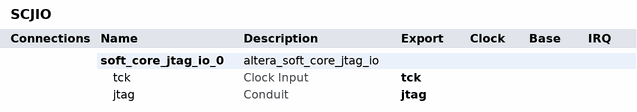
[diagram p0: system contents]
# Platform Designer (Qsys) system SCJIO, Arria 10 10AX115N2F40E2LG
# Parameters at their usual value, and those the tool derives, are not listed.
package require -exact qsys 19.1
create_system SCJIO
set_project_property DEVICE_FAMILY {Arria 10}
set_project_property DEVICE 10AX115N2F40E2LG

add_instance soft_core_jtag_io_0 altera_soft_core_jtag_io 19.1
set_instance_property soft_core_jtag_io_0 AUTO_EXPORT true
set_instance_parameter_value soft_core_jtag_io_0 CONNECTED_TO_JTAG_ATOM false
set_instance_parameter_value soft_core_jtag_io_0 ENABLE_JTAG_IO_SELECTION 0
set_instance_parameter_value soft_core_jtag_io_0 device_family {Arria 10}

# exported interfaces
add_interface jtag conduit end
set_interface_property jtag EXPORT_OF soft_core_jtag_io_0.jtag
add_interface tck clock sink
set_interface_property tck EXPORT_OF soft_core_jtag_io_0.tck

save_system SCJIO.qsys
